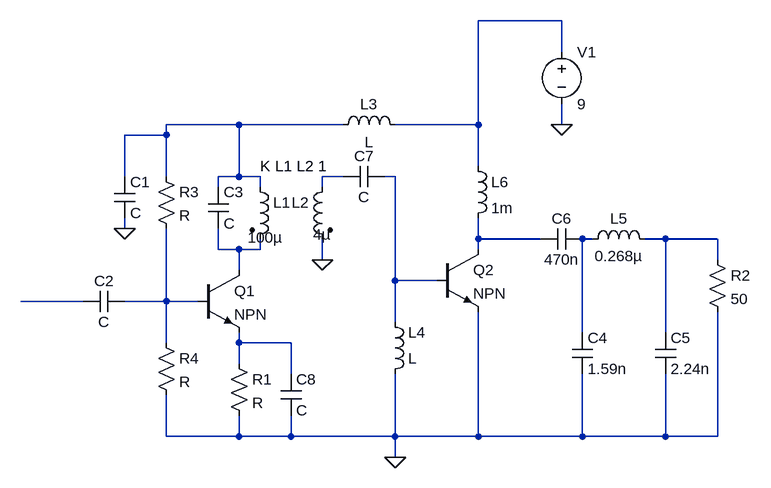
[diagram p0: schematic 2_25.asc]
2_25.asc, the LTspice schematic file:
Version 4
SHEET 1 1016 680
WIRE 720 -160 592 -160
WIRE 720 -112 720 -160
WIRE 224 0 112 0
WIRE 384 0 224 0
WIRE 592 0 592 -160
WIRE 592 0 464 0
WIRE 720 0 720 -32
WIRE 112 16 112 0
WIRE 112 16 48 16
WIRE 592 64 592 0
WIRE 48 80 48 16
WIRE 112 80 112 16
WIRE 224 80 224 0
WIRE 224 80 192 80
WIRE 256 80 224 80
WIRE 384 80 352 80
WIRE 464 80 448 80
WIRE 192 96 192 80
WIRE 256 96 256 80
WIRE 352 96 352 80
WIRE 48 160 48 144
WIRE 592 176 592 144
WIRE 688 176 592 176
WIRE 768 176 752 176
WIRE 880 176 848 176
WIRE 960 176 880 176
WIRE 192 192 192 160
WIRE 224 192 192 192
WIRE 256 192 256 176
WIRE 256 192 224 192
WIRE 592 192 592 176
WIRE 352 208 352 176
WIRE 960 208 960 176
WIRE 224 224 224 192
WIRE 464 240 464 80
WIRE 528 240 464 240
WIRE -16 272 -112 272
WIRE 112 272 112 160
WIRE 112 272 48 272
WIRE 160 272 112 272
WIRE 464 304 464 240
WIRE 752 320 752 176
WIRE 880 320 880 176
WIRE 112 336 112 272
WIRE 224 336 224 320
WIRE 304 336 224 336
WIRE 224 368 224 336
WIRE 304 384 304 336
WIRE 112 480 112 416
WIRE 224 480 224 448
WIRE 224 480 112 480
WIRE 304 480 304 448
WIRE 304 480 224 480
WIRE 464 480 464 384
WIRE 464 480 304 480
WIRE 592 480 592 288
WIRE 592 480 464 480
WIRE 752 480 752 384
WIRE 752 480 592 480
WIRE 880 480 880 384
WIRE 880 480 752 480
WIRE 960 480 960 288
WIRE 960 480 880 480
WIRE 464 512 464 480
FLAG 48 160 0
FLAG 464 512 0
FLAG 352 208 0
FLAG 720 0 0
SYMBOL cap 32 80 R0
SYMATTR InstName C1
SYMBOL cap 48 256 R90
WINDOW 0 0 32 VBottom 2
WINDOW 3 32 32 VTop 2
SYMATTR InstName C2
SYMBOL npn 160 224 R0
SYMATTR InstName Q1
SYMBOL cap 176 96 R0
SYMATTR InstName C3
SYMBOL ind2 240 80 R0
WINDOW 3 -3 94 Left 2
SYMATTR InstName L1
SYMATTR Value 100µ
SYMATTR Type ind
SYMBOL ind2 368 80 M0
WINDOW 3 3 89 Left 2
SYMATTR InstName L2
SYMATTR Value 4µ
SYMATTR Type ind
SYMBOL ind 480 16 M270
WINDOW 0 32 56 VTop 2
WINDOW 3 5 56 VBottom 2
SYMATTR InstName L3
SYMBOL ind 448 400 M180
WINDOW 0 36 80 Left 2
WINDOW 3 36 40 Left 2
SYMATTR InstName L4
SYMBOL ind 752 192 R270
WINDOW 0 32 56 VTop 2
WINDOW 3 5 56 VBottom 2
SYMATTR InstName L5
SYMATTR Value 0.268µ
SYMBOL cap 736 320 R0
SYMATTR InstName C4
SYMATTR Value 1.59n
SYMBOL cap 864 320 R0
SYMATTR InstName C5
SYMATTR Value 2.24n
SYMBOL cap 752 160 R90
WINDOW 0 0 32 VBottom 2
WINDOW 3 32 32 VTop 2
SYMATTR InstName C6
SYMATTR Value 470n
SYMBOL cap 448 64 R90
WINDOW 0 0 32 VBottom 2
WINDOW 3 32 32 VTop 2
SYMATTR InstName C7
SYMBOL res 208 352 R0
SYMATTR InstName R1
SYMBOL cap 288 384 R0
SYMATTR InstName C8
SYMBOL res 944 192 R0
SYMATTR InstName R2
SYMATTR Value 50
SYMBOL res 96 64 R0
SYMATTR InstName R3
SYMBOL res 96 320 R0
SYMATTR InstName R4
SYMBOL npn 528 192 R0
SYMATTR InstName Q2
SYMBOL ind 576 48 R0
SYMATTR InstName L6
SYMATTR Value 1m
SYMBOL voltage 720 -128 R0
WINDOW 123 0 0 Left 0
WINDOW 39 0 0 Left 0
SYMATTR InstName V1
SYMATTR Value 9
TEXT 256 64 Left 2 !K L1 L2 1

The netlist it stands for:
* 2_25.asc
C1 N002 0 C
C2 N010 N009 C
Q1 N008 N010 N011 0 NPN
C3 N002 N008 C
L1 N002 N008 100µ
L2 N003 0 4µ
L3 N001 N002 L
L4 0 N004 L
L5 N006 N007 0.268µ
C4 N006 0 1.59n
C5 N007 0 2.24n
C6 N006 N005 470n
C7 N004 N003 C
R1 N011 0 R
C8 N011 0 C
R2 N007 0 50
R3 N002 N010 R
R4 N010 0 R
Q2 N005 N004 0 0 NPN
L6 N001 N005 1m
V1 N001 0 9
.model NPN NPN
.model PNP PNP
.lib standard.bjt
K L1 L2 1
.backanno
.end